# EasyEDA Pro project ReuseBlock_GD32_3D_2024-08-14.epro, schematic GD32_3D

## Sheets
1 主控芯片GD32
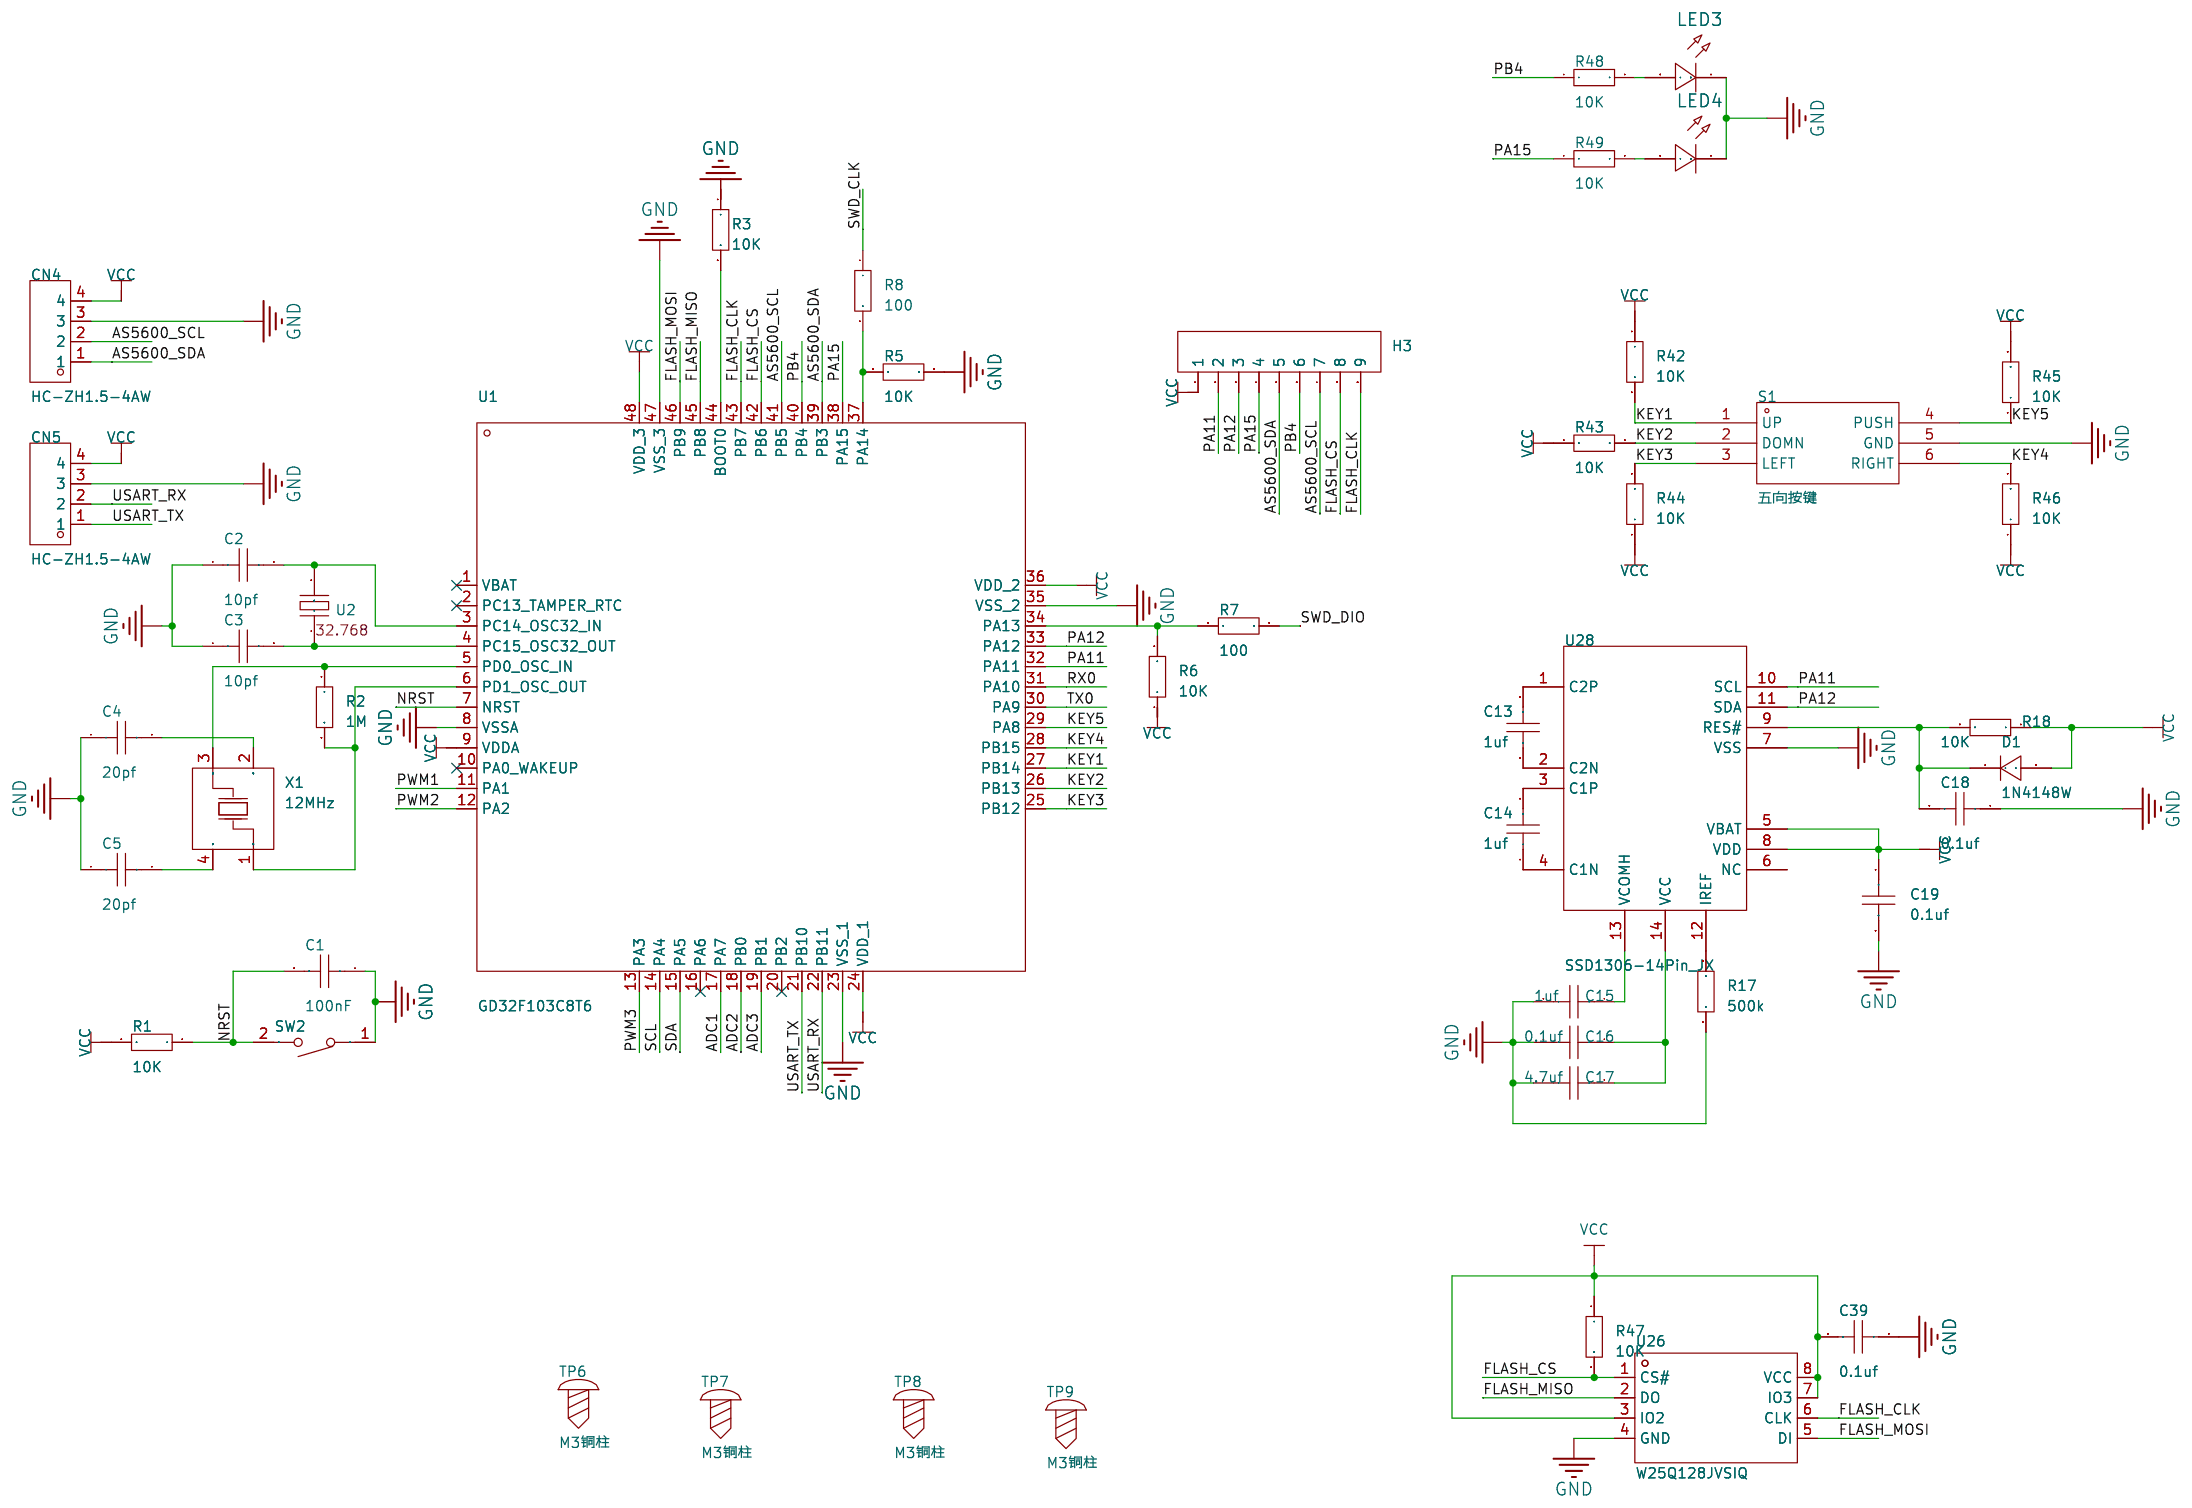
[diagram p0: 主控芯片GD32]
2 电源控制
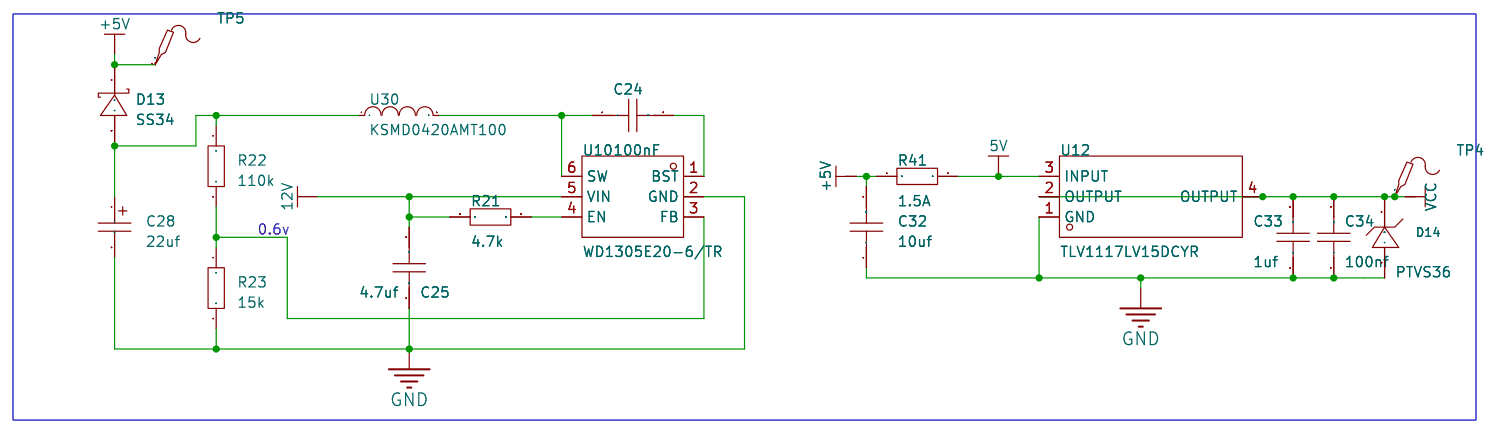
[diagram p1: 电源控制]
3 下载电路
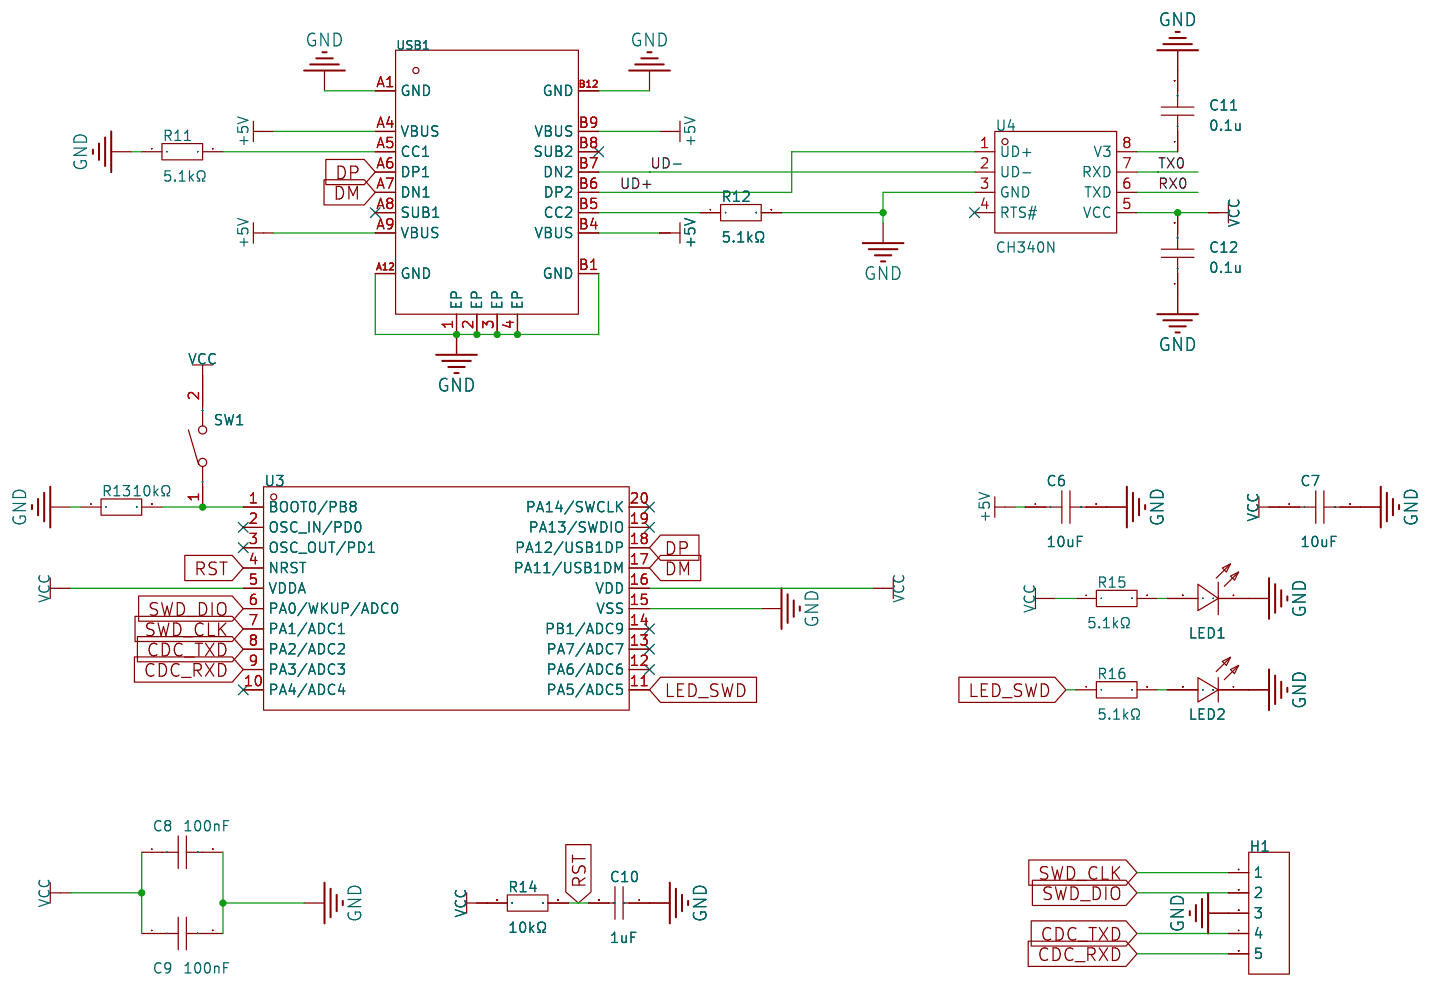
[diagram p2: 下载电路]
4 无刷驱动
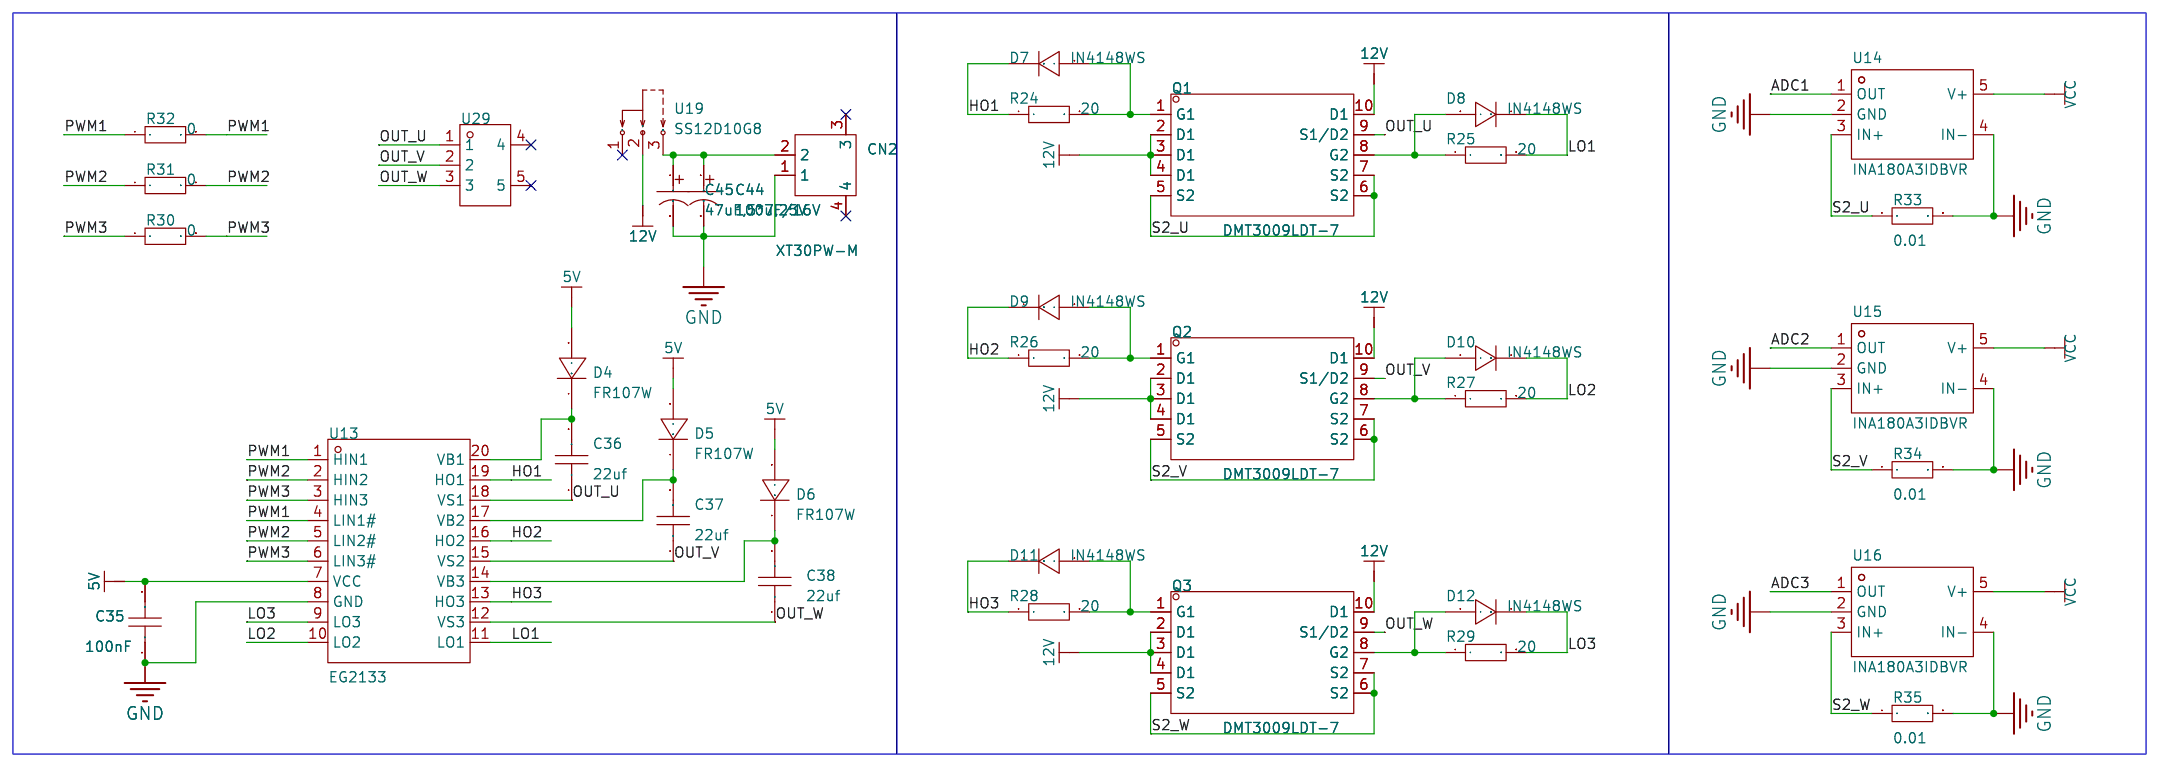
[diagram p3: 无刷驱动]

## Parts
sheet 下载电路
C6  10uF  [C0603]
C7  10uF  [C0603]
C8  100nF  [C0603]
C9  100nF  [C0603]
C10  1uF  [C0603]
C11  0.1u  [C0603]
C12  0.1u  [C0603]
H1  -  [HDR-TH_5P-P2.54-V-F]
LED1  KT-0603R  [LED0603-RD]
LED2  19-217/BHC-ZL1M2RY/3T  [LED0603-FD_BLUE]
R11  5.1kΩ  [R0603]
R12  5.1kΩ  [R0603]
R13  10kΩ  [R0603]
R14  10kΩ  [R0603]
R15  5.1kΩ  [R0603]
R16  5.1kΩ  [R0603]
SW1  -  [SW-SMD_L4.0-W2.9-LS5.0]
U3  CH32V203F6P6  [TSSOP-20_L6.5-W4.4-P0.65-LS6.4-BL]
U4  CH340N  [SOP-8_L4.9-W3.9-P1.27-LS6.0-BL]
USB1  KH-TYPE-C-16P  [USB-C-SMD_KH-TYPE-C-16P]
sheet 主控芯片GD32
C1  100nF  [C0603]
C2  10pf  [C0603]
C3  10pf  [C0603]
C4  20pf  [C0603]
C5  20pf  [C0603]
C13  1uf  [C0603]
C14  1uf  [C0603]
C15  1uf  [C0603]
C16  0.1uf  [C0603]
C17  4.7uf  [C0603]
C18  0.1uf  [C0603]
C19  0.1uf  [C0603]
C39  0.1uf  [C0603]
CN4  HC-ZH1.5-4AW  [CONN-TH_4P-P1.50_HCTL_HC-ZH1.5-4AW]
CN5  HC-ZH1.5-4AW  [CONN-TH_4P-P1.50_HCTL_HC-ZH1.5-4AW]
D1  1N4148W  [SOD-123F_L2.7-W1.6-LS3.8-RD]
H3  -  [HDR-TH_9P-P2.54-V-F-1]
LED3  -  [LED_0603]
LED4  -  [LED_0603]
R1  10K  [R0603]
R2  1M  [R0603]
R3  10K  [R0603]
R5  10K  [R0603]
R6  10K  [R0603]
R7  100  [R0603]
R8  100  [R0603]
R17  500k  [R0603]
R18  10K  [R0603]
R42  10K  [R0603]
R43  10K  [R0603]
R44  10K  [R0603]
R45  10K  [R0603]
R46  10K  [R0603]
R47  10K  [R0603]
R48  10K  [R0603]
R49  10K  [R0603]
S1  五向按键  [7*7]
SW2  -  [SW-SMD_L4.0-W2.9-LS5.0]
TP6  M3铜柱  [M3定位孔]
TP7  M3铜柱  [M3定位孔]
TP8  M3铜柱  [M3定位孔]
TP9  M3铜柱  [M3定位孔]
U1  GD32F103C8T6  [TQFP-48_L7.0-W7.0-P0.50-LS9.0-BL]
U2  32.768  [CRYSTAL-SMD_L3.2-W1.5-1]
U26  W25Q128JVSIQ  [SOIC-8_L5.3-W5.3-P1.27-LS8.0-BL]
U28  SSD1306-14Pin_JX  [SSD1306_SMD14pin_0.91inch]
X1  12MHz  [OSC-SMD_4P-L3.2-W2.5-BL]
sheet 无刷驱动
C35  100nF  [C0603]
C36  22uf  [C0603]
C37  22uf  [C0603]
C38  22uf  [C0603]
C44  100uF 16V  [CAP-6*11]
C45  47uF,5*7,25V  [CAP-TH_BD5.2-P2.00-D0.5-FD]
CN2  XT30PW-M  [CONN-TH_XT30PW-M]
D4  FR107W  [SOD-123F_L2.8-W1.8-LS3.7-RD]
D5  FR107W  [SOD-123F_L2.8-W1.8-LS3.7-RD]
D6  FR107W  [SOD-123F_L2.8-W1.8-LS3.7-RD]
D7  IN4148WS  [SOD-323_L1.8-W1.3-LS2.5-RD]
D8  IN4148WS  [SOD-323_L1.8-W1.3-LS2.5-RD]
D9  IN4148WS  [SOD-323_L1.8-W1.3-LS2.5-RD]
D10  IN4148WS  [SOD-323_L1.8-W1.3-LS2.5-RD]
D11  IN4148WS  [SOD-323_L1.8-W1.3-LS2.5-RD]
D12  IN4148WS  [SOD-323_L1.8-W1.3-LS2.5-RD]
Q1  DMT3009LDT-7  [V-DFN3030-8K_L3.0-W3.0-P0.65-BL]
Q2  DMT3009LDT-7  [V-DFN3030-8K_L3.0-W3.0-P0.65-BL]
Q3  DMT3009LDT-7  [V-DFN3030-8K_L3.0-W3.0-P0.65-BL]
R24  20  [R0603]
R25  20  [R0603]
R26  20  [R0603]
R27  20  [R0603]
R28  20  [R0603]
R29  20  [R0603]
R30  0  [R0603]
R31  0  [R0603]
R32  0  [R0603]
R33  0.01  [R0603]
R34  0.01  [R0603]
R35  0.01  [R0603]
U13  EG2133  [TSSOP-20_L6.5-W4.4-P0.65-LS6.4-BL]
U14  INA180A3IDBVR  [SOT-23-5_L3.0-W1.7-P0.95-LS2.8-BR]
U15  INA180A3IDBVR  [SOT-23-5_L3.0-W1.7-P0.95-LS2.8-BR]
U16  INA180A3IDBVR  [SOT-23-5_L3.0-W1.7-P0.95-LS2.8-BR]
U19  SS12D10G8  [SW-TH_SHOU-HAN_SS12D10G4]
U29  -  [CONN-TH_MR30PW-M30-G-Y]
sheet 电源控制
C24  100nF  [C0603]
C25  4.7uf  [C0603]
C28  22uf  [C_Ele_SMD_5x5.4mm]
C32  10uf  [C0805]
C33  1uf  [C0603]
C34  100nf  [C0603]
D13  SS34  [SMA_L4.3-W2.6-LS5.0-RD]
D14  PTVS36  [SOD-123_L2.8-W1.8-LS3.7-RD]
R21  4.7k  [R0603]
R22  110k  [R0603]
R23  15k  [R0603]
R41  1.5A  [R0805]
TP4  -  [Test-Point-0.5mm]
TP5  -  [Test-Point-0.5mm]
U10  WD1305E20-6/TR  [SOT-23-6_L2.9-W1.6-P0.95-LS2.8-BR]
U12  TLV1117LV15DCYR  [SOT-223-4_L6.5-W3.5-P2.30-LS7.0-BR]
U30  KSMD0420AMT100  [IND-SMD_L4.4-W4.2-A]

## Library data of the parts
C6 C7 C11 C12 = CL10A106KP8NNNC: 容值:10uF;精度:±10%;额定电压:10V;材质(温度系数):X5R;; LCSC Part Name: 10uF ±10% 10V; Supplier Part: C19702; Manufacturer: SAMSUNG(三星); Supplier Footprint: 0603; JLCPCB Part Class: Basic Part; Datasheet: https://atta.szlcsc.com/upload/public/pdf/source/20160103/1457707703378.pdf; Supplier: LCSC; Tolerance: ±10%; Voltage Rated: 10V; Temperature Coefficient: X5R
C8 C9 = CC0603KRX7R9BB104: 容值:100nF;精度:±10%;额定电压:50V;材质(温度系数):X7R;; LCSC Part Name: 100nF ±10% 50V; Supplier Part: C14663; Manufacturer: YAGEO(国巨); Supplier Footprint: 0603; JLCPCB Part Class: Basic Part; Datasheet: https://atta.szlcsc.com/upload/public/pdf/source/20180910/C282072_33301C7F631E79921B82A8DAC6BCC5B3.pdf; Supplier: LCSC; Tolerance: ±10%; Voltage Rated: 50V; Temperature Coefficient: X7R
C10 = CL10A105KB8NNNC: 容值:1uF;精度:±10%;额定电压:50V;材质(温度系数):X5R;; LCSC Part Name: 1uF ±10% 50V; Supplier Part: C15849; Manufacturer: SAMSUNG(三星); Supplier Footprint: 0603; JLCPCB Part Class: Basic Part; Datasheet: https://atta.szlcsc.com/upload/public/pdf/source/20160103/1457707679084.pdf; Supplier: LCSC; Tolerance: ±10%; Voltage Rated: 50V; Temperature Coefficient: X5R
H1 = HDR-F_2.54_1x5P: Supplier Part: C50950; Supplier Footprint: 插件
LED1 = KT-0603R: 发光颜色:红灯;二极管配置:-;透镜颜色:-;主波长:-;色温:-;功率:-;发光角度:-;安装方式:-;工作温度:-40℃~+85℃;; LCSC Part Name: 0603 红灯 高亮; Supplier Part: C2286; Manufacturer: KENTO; Supplier Footprint: 0603; JLCPCB Part Class: Basic Part; Datasheet: https://atta.szlcsc.com/upload/public/pdf/source/20160616/1466072038404.pdf; Supplier: LCSC; Emitted Color: 红灯; Operating Temperature: -40℃~+85℃
LED2 = 19-217/BHC-ZL1M2RY/3T: 发光颜色:蓝灯;二极管配置:-;主波长:465nm~475nm;色温:-;功率:110mW;安装方式:-;; LCSC Part Name: 蓝灯; Supplier Part: C72041; Manufacturer: EVERLIGHT(亿光); Supplier Footprint: 0603; JLCPCB Part Class: Basic Part; Datasheet: https://atta.szlcsc.com/upload/public/pdf/source/20170116/1484561237273.pdf; Supplier: LCSC; Emitted Color: 蓝灯; Lens Color: 无色透明; Dominant Wavelength: 465nm~475nm; Peak Wavelength: 468nm; Forward Current: 5mA; Power Dissipation: 110mW; Viewing Angle: 120°; Operating Temperature: -40℃~+85℃
R11 R12 R15 R16 = 0603WAF5101T5E: 电阻类型:厚膜电阻;阻值:5.1kΩ;精度:±1%;功率:100mW;; LCSC Part Name: 5.1kΩ ±1% 100mW; Supplier Part: C23186; Manufacturer: UNI-ROYAL(厚声); Supplier Footprint: 0603; JLCPCB Part Class: Basic Part; Datasheet: https://atta.szlcsc.com/upload/public/pdf/source/20200306/C422600_1E6D84923E4A46A82E41ADD87F860B5C.pdf; Supplier: LCSC; Type: 厚膜电阻; Tolerance: ±1%; Power(Watts): 100mW; Temperature Coefficient: ±100ppm/℃; Overload Voltage (Max): 75V; Operating Temperature Range: -55℃~+155℃
R13 R14 = 0603WAF1002T5E: 电阻类型:厚膜电阻;阻值:10kΩ;精度:±1%;功率:100mW;; LCSC Part Name: 厚膜电阻 10kΩ ±1% 100mW; Supplier Part: C25804; Manufacturer: UNI-ROYAL(厚声); Supplier Footprint: 0603; JLCPCB Part Class: Basic Part; Datasheet: https://atta.szlcsc.com/upload/public/pdf/source/20200306/C422600_1E6D84923E4A46A82E41ADD87F860B5C.pdf; Supplier: LCSC; Type: 厚膜电阻; Tolerance: ±1%; Power(Watts): 100mW; Temperature Coefficient: ±100ppm/℃; Overload Voltage (Max): 75V; Operating Temperature Range: -55℃~+155℃
SW1 SW2 = 3*4*2 贴片开关: 3×4×2.0 160GF 贴片无柱轻触开关; LCSC Part Name: 3×4×2.0 160gf 贴片无柱轻触开关; Supplier Part: C720477; Manufacturer: XUNPU(讯普); Manufacturer Part: TS-1088-AR02016; Supplier Footprint: SMD,3x4x2mm; JLCPCB Part Class: 扩展库; Datasheet: https://atta.szlcsc.com/upload/public/pdf/source/20200810/C720475_60D09DD6C54279ADDB2DC25100F1CC11.pdf; Supplier: LCSC
U3 = CH32V203F6P6: Supplier Part: C3040880; Supplier Footprint: TSSOP-20; JLCPCB Part Class: 扩展库; Datasheet: https://atta.szlcsc.com/upload/public/pdf/source/20220510/52F9A259BF681E52EE311138C4DB2910.pdf; Supplier: LCSC
U4 = CH340N: LCSC Part Name: USB转串口芯片 CH340; Supplier Part: C2977777; Manufacturer: WCH(南京沁恒); Supplier Footprint: SOP-8; JLCPCB Part Class: 扩展库; Datasheet: https://atta.szlcsc.com/upload/public/pdf/source/20230530/6E401E9554E9F5311886CC8B3F89B62E.pdf; Supplier: LCSC
USB1 = KH-TYPE-C-16P: Type-C母座 16PIN 立式四角贴板无压片; LCSC Part Name: Type-C母座; Supplier Part: C709357; Manufacturer: kinghelm(金航标); JLCPCB Part Class: Extended Part; Supplier: LCSC
C1-C5 C13-C19 C24 C25 C33-C39 = CAP_0603: Supplier Footprint: 0603
CN4 CN5 = HC-ZH1.5-4AW: 插针结构:1x4P;间距:1.5mm;安装方式:弯插;参考系列:ZH;总PIN数:4P;排数:1;每排PIN数:4;行距:-;额定电流:1A;触头材质:黄铜;触头镀层:锡;工作温度范围:-25℃~+85℃;; LCSC Part Name: 1x4P 间距:1.5mm 弯插 系列:ZH; Supplier Part: C2845567; Manufacturer: HCTL(华灿天禄); Supplier Footprint: 弯插,P=1.5mm; JLCPCB Part Class: 扩展库; Datasheet: https://atta.szlcsc.com/upload/public/pdf/source/20230711/CEA84C90BC30863458C9BDB0466F53F6.pdf; Supplier: LCSC; Pins Structure: 1x4P; Pitch: 1.5mm; Mounting Style: 弯插; Reference Series: ZH; Number of Pins: 4P; Number of Rows: 1; Number of PINs Per Row: 4; Current Rating (Max): 1A; Contact Material: 黄铜; Contact Plating: 锡; Operating Temperature Range: -25℃~+85℃
D1 = 1N4148W_C81598: 二极管配置:独立式;正向压降(Vf):1V@50mA;直流反向耐压(Vr):75V;平均整流电流(Io):150mA;功率:400mW;反向恢复时间(trr):4ns;; LCSC Part Name: 电压:75V 电流:150mA; Supplier Part: C81598; Manufacturer: ST(先科); Supplier Footprint: SOD-123; JLCPCB Part Class: 基础库; Datasheet: https://atta.szlcsc.com/upload/public/pdf/source/20161024/1477288446905.pdf; Supplier: LCSC; Diode Configuration: 独立式; Forward Voltage (Vf@If): 1V@50mA; Reverse Voltage (Vr): 75V; Average Rectified Current (Io): 150mA; Power Dissipation: 400mW; Reverse Leakage Current: 1uA@75V; Reverse Recovery Time (trr): 4ns
H3 = HDR-F_2.54_1x9P: Supplier Part: C39576; Supplier Footprint: 插件
LED3 LED4 = LED_0603-R: Supplier Footprint: 0603
R1-R3 R5-R8 R17 R18 R21-R35 R42-R49 = Res_0603: Supplier Footprint: 0603
S1 = 五向按键
TP6-TP9 = M3铜柱
U1 = GD32F103C8T6: CPU内核:CM3;程序存储容量:64KB;RAM总容量:20KB;GPIO端口数量:37;工作电压范围:2.6V~3.6V;CPU最大主频:108MHz;程序存储器类型:FLASH;; LCSC Part Name: Arm® Cortex®-M3 32-bit MCU; Supplier Part: C77994; Manufacturer: GigaDevice(兆易创新); Supplier Footprint: LQFP-48(7x7); JLCPCB Part Class: 扩展库; Datasheet: https://atta.szlcsc.com/upload/public/pdf/source/20160910/1473490296871.pdf; Supplier: LCSC; CPU Core: CM3; Program Storage Size: 64KB; RAM Size: 20KB; GPIO Ports Number: 37; Operating Voltage Range: 2.6V~3.6V; CPU Maximum Speed: 108MHz; Program Memory Type: FLASH; Operating Temperature Range: -40℃~+85℃; ADC (Bit): 12bit; PWM (Bit): 16bit; 16Bit Timer: 3; CAN: 1; UART/USART: 3; I2C: 2; SPI: 2; Universal Serial Bus: 有; Peripheral/Function: 片载温度传感器；DMA；看门狗；LIN总线协议；PWM；IrDA；SDIO；RTC实时时钟; Watchdog: 有; Real-Time Clock: 有; Infrared Data Association: 有; Secure Digital Input and Output: 有; Direct Memory Access: 有; Internal Oscillator: 有
U2 = 晶体32.768K+-20PPM10PFTFX02: Supplier Part: C9900014618; JLCPCB Part Class: 扩展库; Supplier: LCSC
U26 = W25Q128JVSIQ: 接口类型:-;存储容量:128Mbit;时钟频率(fc):-;; LCSC Part Name: W25Q128JVSIQ 编带; Supplier Part: C97521; Manufacturer: WINBOND(华邦); Supplier Footprint: SOIC-8-208mil; JLCPCB Part Class: 基础库; Datasheet: https://atta.szlcsc.com/upload/public/pdf/source/20170316/1489627409956.pdf; Supplier: LCSC; Memory Size: 128Mbit
U28 = SSD1306-14Pin_0.91_JX
X1 = X322512MSB4SI: 晶振类型:贴片晶振;频率:12MHz;常温频差:±10ppm;外接负载电容:20pF;频率稳定度(全温):±20ppm;; LCSC Part Name: 12MHz ±10ppm 20pF; Supplier Part: C9002; Manufacturer: YXC(扬兴晶振); Supplier Footprint: SMD3225-4P; JLCPCB Part Class: 基础库; Datasheet: https://atta.szlcsc.com/upload/public/pdf/source/20240329/19D5F850207469550BEB00D7DFEDBC7A.pdf; Supplier: LCSC; Crystal Type: 贴片晶振; Normal temperature Frequency Tolerance: ±10ppm; External load capacitor: 20pF; Frequency Stability(Full temperature range): ±20ppm; Operating Temperature: -40℃~+85℃
C44 = ks107m016d07rr0vh2fp0: LCSC Part Name: 100uF ±20% 16V; Supplier Part: C43803; Manufacturer: CX(承兴); Manufacturer Part: KS107M016D07RR0VH2FP0; Supplier Footprint: 径向引线,5x7mm; JLCPCB Part Class: 扩展库; Datasheet: https://atta.szlcsc.com/upload/public/pdf/source/20211027/7B10195EF01EB9374BE8935690E3D906.pdf; Supplier: LCSC; Tolerance: ±20%; Rated Voltage: 16V; φD: 5mm; L: 7mm; Lead Spacing: 2mm; Lifetime @ Temp: 1000hrs@105
C45 = 47uF,5*7,25V: Supplier Part: C9900009630; Supplier Footprint: CAP-TH; JLCPCB Part Class: 扩展库; Supplier: LCSC
CN2 = XT30PW-M: 类别:-;类型1:-;; LCSC Part Name: AMASS(艾迈斯)航模插头 卧式弯脚 XT30PW-M公头; Supplier Part: C431092; Manufacturer: AMASS(艾迈斯); JLCPCB Part Class: 扩展库; Datasheet: https://atta.szlcsc.com/upload/public/pdf/source/20220222/6A9F22F7850E25B33E1BE430ADF8560B.pdf; Supplier: LCSC; Brand: 艾迈斯; Type: 航模插头; RatedVoltage: DC 500V; InterfaceType: 公头; RatedCurrent: 15A; RecommendedWireGauge: 16/18/20AWG; contact resistance: 1.2mΩ; specifications: 2pin
D4-D6 = FR107W_C108820: 二极管配置:独立式;正向压降(Vf):1.3V@1A;直流反向耐压(Vr):1kV;平均整流电流(Io):1A;反向恢复时间(trr):500ns;; LCSC Part Name: 电压:1kV 电流:1A; Supplier Part: C108820; Manufacturer: 晶导微电子; Supplier Footprint: SOD-123F; JLCPCB Part Class: 扩展库; Datasheet: https://atta.szlcsc.com/upload/public/pdf/source/20180125/C169510_15168663723441303211.pdf; Supplier: LCSC; Diode Configuration: 独立式; Forward Voltage (Vf@If): 1.3V@1A; Reverse Voltage (Vr): 1kV; Average Rectified Current (Io): 1A; Reverse Leakage Current: 5uA@1kV; Reverse Recovery Time (trr): 500ns; Operating Temperature: -55℃~+150℃@(Tj)
D7-D12 = IN4148WS: 二极管配置:独立式;正向压降(Vf):1V@10mA;直流反向耐压(Vr):100V;平均整流电流(Io):200mA;功率:200mW;反向恢复时间(trr):4ns;; LCSC Part Name: 电压:100V 电流:200mA; Supplier Part: C417545; Manufacturer: LRC(乐山无线电); Supplier Footprint: SOD-323; JLCPCB Part Class: 扩展库; Datasheet: https://atta.szlcsc.com/upload/public/pdf/source/20190911/C417545_CB999573A39316D3E44B0FF1B4B78E30.pdf; Supplier: LCSC; Diode Configuration: 独立式; Forward Voltage (Vf@If): 1V@10mA; Reverse Voltage (Vr): 100V; Average Rectified Current (Io): 200mA; Power Dissipation: 200mW; Reverse Leakage Current: 5uA@75V; Reverse Recovery Time (trr): 4ns
Q1-Q3 = DMT3009LDT-7: 类型:2个N沟道;漏源电压(Vdss):30V;连续漏极电流(Id):30A;功率(Pd):1.2W;导通电阻(RDS(on)@Vgs,Id):11.1mΩ@10V,14.4A;阈值电压(Vgs(th)@Id):3V@250uA;; LCSC Part Name: 2个N沟道 耐压:30V 电流:30A; Supplier Part: C155503; Manufacturer: DIODES(美台); Supplier Footprint: V-DFN3030-8K; JLCPCB Part Class: 扩展库; Datasheet: https://atta.szlcsc.com/upload/public/pdf/source/20181206/C155503_C9E5F849506B8E5BF51429E256EC4CEC.pdf; Supplier: LCSC; Type: 2个N沟道; Drain Source Voltage (Vdss): 30V; Continuous Drain Current (Id): 30A; Power Dissipation (Pd): 1.2W; Drain Source On Resistance (RDS(on)@Vgs,Id): 11.1mΩ@10V,14.4A; Gate Threshold Voltage (Vgs(th)@Id): 3V@250uA; Configuration: 半桥
U13 = EG2133: 同 C190343 为一种料，但是包装形式为盘装。; Supplier Part: C405330; Manufacturer: EG(屹晶微); Supplier Footprint: TSSOP-20; JLCPCB Part Class: 扩展库; Datasheet: https://atta.szlcsc.com/upload/public/pdf/source/20220627/F8A393EEBF3325F22DCB485BC683267F.pdf; Supplier: LCSC
U14-U16 = INA180A3IDBVR: 放大器数:单路;; Supplier Part: C122882; Manufacturer: TI(德州仪器); Supplier Footprint: SOT-23-5; JLCPCB Part Class: 扩展库; Datasheet: https://www.ti.com/cn/lit/gpn/ina180; Supplier: LCSC; Number of Channels: 单路; Supply Current: 260uA; Operating Temperature: -40℃~+125℃
U19 = SS12D10G8: Supplier Part: C9900030309; Supplier Footprint: SW-TH; JLCPCB Part Class: 扩展库; Supplier: LCSC
U29 = MR30PW
C28 = C_Ele_SMD_5x5.4mm: Supplier Footprint: SMD,5x5.4mm
C32 = CAP_0805: Supplier Footprint: 0805
D13 = SS34: Supplier Part: C9900023345; Supplier Footprint: SMA,DO-214AC; JLCPCB Part Class: 扩展库; Supplier: LCSC
D14 = PTVS36VS1UTR,115: 反向截止电压(Vrwm):36V;最大钳位电压:58.1V;峰值脉冲电流(Ipp)@10/1000us:6.9A;峰值脉冲功率(Ppp)@10/1000us:400W;击穿电压:40V;; Supplier Part: C553418; Manufacturer: Nexperia(安世); Supplier Footprint: SOD-123W; JLCPCB Part Class: 扩展库; Datasheet: https://atta.szlcsc.com/upload/public/pdf/source/20191127/C461226_0EAF7361129FB0A43C36DE7099A047ED.pdf; Supplier: LCSC; Reverse Stand-Off Voltage (Vrwm): 36V; Maximum Clamping Voltage: 58.1V; Peak Pulse Current (Ipp)@10/1000us: 6.9A; Peak Pulse Power Dissipation (Ppp)@10/1000us: 400W; Breakdown Voltage: 40V; Reverse Leakage Current (Ir): 100nA; Type: TVS
R41 = Res_0805: Supplier Footprint: 0805
TP4 TP5 = Test-Point: Test Point 测试点
U10 = WD1305E20-6/TR: Supplier Part: C2931306; Manufacturer: WILLSEMI(韦尔); Supplier Footprint: SOT-23-6L; JLCPCB Part Class: 扩展库; Datasheet: https://atta.szlcsc.com/upload/public/pdf/source/20211214/D000F77CC695450852A1778F47850752.pdf; Supplier: LCSC
U12 = TLV1117LV15DCYR: 输出类型:固定;最大输入电压:5.5V;输出电压:1.5V;最大输出电流:1A;电源纹波抑制比(PSRR):75dB@(120Hz);输出极性:正极;; Supplier Part: C507262; Manufacturer: TI(德州仪器); Supplier Footprint: SOT-223-4; JLCPCB Part Class: 扩展库; Datasheet: https://www.ti.com/cn/lit/gpn/tlv1117lv; Supplier: LCSC; Output Type: 固定; Maximum Input Voltage: 5.5V; Output Voltage: 1.5V; MAX Output Current: 1A; Power Supply Rejection Ratio (PSRR): 75dB@(120Hz); Dropout Voltage: 1.3V@(800mA); standby current: 100uA; Operating Temperature: -40℃~+125℃; Output Polarity: 正极; Number of Outputs: 1
U30 = KSMD0420AMT100: Supplier Part: C9900025327; Supplier Footprint: 0420; JLCPCB Part Class: 扩展库; Supplier: LCSC

## Nets
5V: C35.2 D4.2(A) D5.2(A) D6.2(A) R41.2 U12.3(INPUT) U13.7(VCC)
12V: C25.2 Q1.2(D1) Q1.3(D1) Q1.4(D1) Q1.10(D1) Q2.2(D1) Q2.3(D1) Q2.4(D1) Q2.10(D1) Q3.2(D1) Q3.3(D1) Q3.4(D1) Q3.10(D1) R21.1 U10.5(VIN) U19.2
+5V: C6.1 C32.2 D13.1(K) R41.1 TP5.1 USB1.A4(VBUS) USB1.A9(VBUS) USB1.B4(VBUS) USB1.B9(VBUS)
GND: C1.1 C2.1 C3.1 C4.1 C5.1 C6.2 C7.2 C8.2 C9.2 C10.1 C11.2 C12.1 C15.2 C16.2 C17.2 C18.1 C19.2 C25.1 C28.2 C32.1 C33.1 C34.1 C35.1 C39.1 C44.2 C45.2 CN2.1 CN4.3 CN5.3 D14.2(A) H1.3 LED1.1(K) LED2.1(C) LED3.1(C) LED4.1(C) R3.1 R5.2 R11.1 R12.2 R13.1 R17.1 R23.2 R33.2 R34.2 R35.2 S1.5(GND) SW2.1 U1.8(VSSA) U1.23(VSS_1) U1.35(VSS_2) U1.47(VSS_3) U3.15(VSS) U4.3(GND) U10.2(GND) U12.1(GND) U13.8(GND) U14.2(GND) U14.4(IN-) U15.2(GND) U15.4(IN-) U16.2(GND) U16.4(IN-) U26.4(GND) U28.7(VSS) USB1.1(EP) USB1.2(EP) USB1.3(EP) USB1.4(EP) USB1.A1(GND) USB1.A12(GND) USB1.B1(GND) USB1.B12(GND)
VCC: C7.1 C8.1 C9.1 C12.2 C19.1 C33.2 C34.2 C39.2 CN4.4 CN5.4 D1.2(A) D14.1(C) H3.1 R1.2 R6.1 R14.2 R15.1 R18.1 R42.1 R43.1 R44.1 R45.2 R46.1 R47.1 SW1.2 TP4.1 U1.9(VDDA) U1.24(VDD_1) U1.36(VDD_2) U1.48(VDD_3) U3.5(VDDA) U3.16(VDD) U4.5(VCC) U12.2(OUTPUT) U12.4(OUTPUT) U14.5(V+) U15.5(V+) U16.5(V+) U26.3(IO2) U26.7(IO3) U26.8(VCC) U28.5(VBAT) U28.8(VDD)
ADC1: U1.17(PA7) U14.1(OUT)
ADC2: U1.18(PB0) U15.1(OUT)
ADC3: U1.19(PB1) U16.1(OUT)
AS5600_SCL: CN4.2 H3.7 U1.41(PB5)
AS5600_SDA: CN4.1 H3.5 U1.39(PB3)
CDC_RXD: H1.5 U3.9(PA3/ADC3)
CDC_TXD: H1.4 U3.8(PA2/ADC2)
DM: U3.17(PA11/USB1DM) USB1.A7(DN1)
DP: U3.18(PA12/USB1DP) USB1.A6(DP1)
FLASH_CLK: H3.9 U1.43(PB7) U26.6(CLK)
FLASH_CS: H3.8 R47.2 U1.42(PB6) U26.1(CS#)
FLASH_MISO: U1.45(PB8) U26.2(DO)
FLASH_MOSI: U1.46(PB9) U26.5(DI)
HO1: D7.1(C) R24.1 U13.19(HO1)
HO2: D9.1(C) R26.1 U13.16(HO2)
HO3: D11.1(C) R28.1 U13.13(HO3)
KEY1: R42.2 S1.1(UP) U1.27(PB14)
KEY2: R43.2 S1.2(DOMN) U1.26(PB13)
KEY3: R44.2 S1.3(LEFT) U1.25(PB12)
KEY4: R46.2 S1.6(RIGHT) U1.28(PB15)
KEY5: R45.1 S1.4(PUSH) U1.29(PA8)
LED_SWD: R16.1 U3.11(PA5/ADC5)
LO1: D8.1(C) R25.2 U13.11(LO1)
LO2: D10.1(C) R27.2 U13.10(LO2)
LO3: D12.1(C) R29.2 U13.9(LO3)
NRST: C1.2 R1.1 SW2.2 U1.7(NRST)
OUT_U: C36.1 Q1.9(S1/D2) U13.18(VS1) U29.1
OUT_V: C37.1 Q2.9(S1/D2) U13.15(VS2) U29.2
OUT_W: C38.1 Q3.9(S1/D2) U13.12(VS3) U29.3
PA11: H3.2 U1.32(PA11) U28.10(SCL)
PA12: H3.3 U1.33(PA12) U28.11(SDA)
PA15: H3.4 R49.1 U1.38(PA15)
PB4: H3.6 R48.1 U1.40(PB4)
PWM1: R32.1 R32.2 U1.11(PA1) U13.1(HIN1) U13.4(LIN1#)
PWM2: R31.1 R31.2 U1.12(PA2) U13.2(HIN2) U13.5(LIN2#)
PWM3: R30.1 R30.2 U1.13(PA3) U13.3(HIN3) U13.6(LIN3#)
RST: C10.2 R14.1 U3.4(NRST)
RX0: U1.31(PA10) U4.6(TXD)
S2_U: Q1.5(S2) Q1.6(S2) Q1.7(S2) R33.1 U14.3(IN+)
S2_V: Q2.5(S2) Q2.6(S2) Q2.7(S2) R34.1 U15.3(IN+)
S2_W: Q3.5(S2) Q3.6(S2) Q3.7(S2) R35.1 U16.3(IN+)
SCL: U1.14(PA4)
SDA: U1.15(PA5)
SWD_CLK: H1.1 R8.1 U3.7(PA1/ADC1)
SWD_DIO: H1.2 R7.1 U3.6(PA0/WKUP/ADC0)
TX0: U1.30(PA9) U4.7(RXD)
UD+: U4.1(UD+) USB1.B6(DP2)
UD-: U4.2(UD-) USB1.B7(DN2)
USART_RX: CN5.2 U1.22(PB11)
USART_TX: CN5.1 U1.21(PB10)
$2N749: R21.2 U10.4(EN)
$2N836: C24.1 U10.6(SW) U30.2
$2N843: C24.2 U10.1(BST)
$2N1195: R22.2 R23.1 U10.3(FB)
$2N1887: C28.1 D13.2(A) R22.1 U30.1
$4N8043: C11.1 U4.8(V3)
$5N1150: D7.2(A) Q1.1(G1) R24.2
$5N1261: D8.2(A) Q1.8(G2) R25.1
$5N1488: D9.2(A) Q2.1(G1) R26.2
$5N1506: D10.2(A) Q2.8(G2) R27.1
$5N1733: D11.2(A) Q3.1(G1) R28.2
$5N1751: D12.2(A) Q3.8(G2) R29.1
$5N6748: C44.1 C45.1 CN2.2 U19.3
Net-(C2-2): C2.2 U1.3(PC14_OSC32_IN) U2.2(GND)
Net-(C3-2): C3.2 U1.4(PC15_OSC32_OUT) U2.1
Net-(C4-2): C4.2 X1.2(GND)
Net-(C5-2): C5.2 X1.4(GND)
Net-(C13-1): C13.1 U28.2(C2N)
Net-(C13-2): C13.2 U28.1(C2P)
Net-(C14-1): C14.1 U28.4(C1N)
Net-(C14-2): C14.2 U28.3(C1P)
Net-(C15-1): C15.1 U28.13(VCOMH)
Net-(C16-1): C16.1 C17.1 U28.14(VCC)
Net-(C18-2): C18.2 D1.1(K) R18.2 U28.9(RES#)
Net-(C36-2): C36.2 D4.1(C) U13.20(VB1)
Net-(C37-2): C37.2 D5.1(C) U13.17(VB2)
Net-(C38-2): C38.2 D6.1(C) U13.14(VB3)
Net-(LED1-2): LED1.2(A) R15.2
Net-(LED2-2): LED2.2(A) R16.2
Net-(LED3-2): LED3.2(A) R48.2
Net-(LED4-2): LED4.2(A) R49.2
Net-(R2-1): R2.1 U1.5(PD0_OSC_IN) X1.3(OSC2)
Net-(R2-2): R2.2 U1.6(PD1_OSC_OUT) X1.1(OSC1)
Net-(R3-2): R3.2 U1.44(BOOT0)
Net-(R5-1): R5.1 R8.2 U1.37(PA14)
Net-(R6-2): R6.2 R7.2 U1.34(PA13)
Net-(R11-2): R11.2 USB1.A5(CC1)
Net-(R12-1): R12.1 USB1.B5(CC2)
Net-(R13-2): R13.2 SW1.1 U3.1(BOOT0/PB8)
Net-(R17-2): R17.2 U28.12(IREF)

Not connected (* = marked no-connect by the designer): CN2 3* 4*; U1 1(VBAT)* 2(PC13_TAMPER_RTC)* 10(PA0_WAKEUP)* 16(PA6)* 20(PB2)*; U3 2(OSC_IN/PD0)* 3(OSC_OUT/PD1)* 10(PA4/ADC4)* 12(PA6/ADC6)* 13(PA7/ADC7)* 14(PB1/ADC9)* 19(PA13/SWDIO)* 20(PA14/SWCLK)*; U4 4(RTS#)*; U19 1*; U28 6(NC); U29 4* 5*; USB1 A8(SUB1)* B8(SUB2)*

## Notes on the sheets
sheet 2
- 0.6v
